# EAGLE design OpenLog (EAGLE 6.5.0)
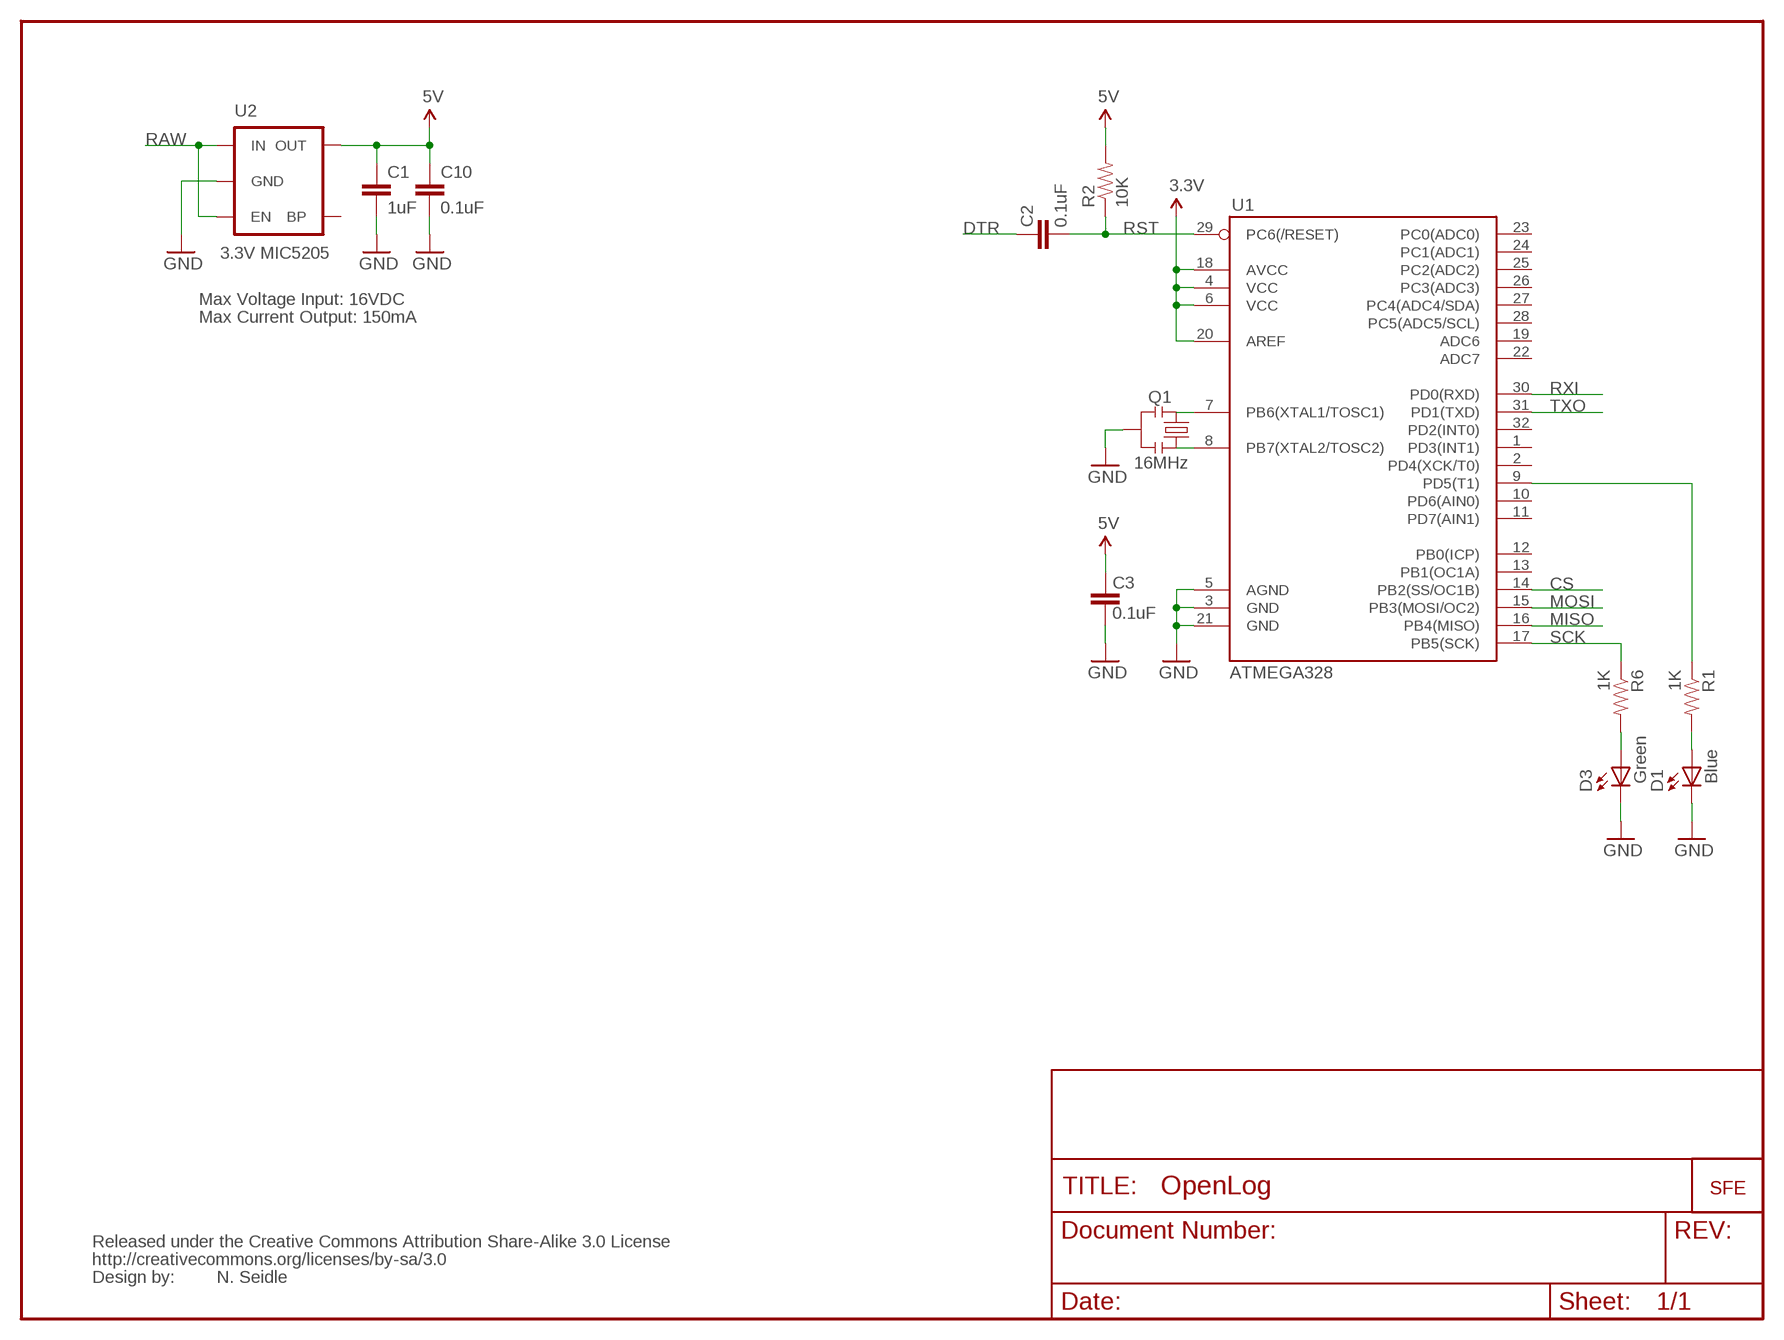
[diagram p0: schematic, sheet 1]

## Parts
C1  1uF  CAP0402-CAP  [0402-CAP]
C2  0.1uF  CAP0402-CAP  [0402-CAP]
C3  0.1uF  CAP0402-CAP  [0402-CAP]
C10  0.1uF  CAP0402-CAP  [0402-CAP]
D1  Blue  LED0603  [LED-0603]
D3  Green  LED0603  [LED-0603]
Q1  16MHz  RESONATORSMD  [RESONATOR-SMD]
R1  1K  RESISTOR0402-RES  [0402-RES]
R2  10K  RESISTOR0402-RES  [0402-RES]
R6  1K  RESISTOR0402-RES  [0402-RES]
U1  ATMEGA328  ATMEGA168  [TQFP32-08]
U2  3.3V MIC5205  V_REG_LDOSMD  [SOT23-5]
U$1  LOGO-SFESK  [SFE-LOGO-FLAME]
U$2  CREATIVE_COMMONS  [CREATIVE_COMMONS]

## Nets
3.3V: U1.4(VCC) U1.6(VCC) U1.18(AVCC) U1.20(AREF)
5V: C1.1 C3.2 C10.1 R2.2 U2.5(OUT)
CS: U1.14(PB2(SS/OC1B))
DTR: C2.2
GND [vcc]: C1.2 C3.1 C10.2 D1.C D3.C Q1.2 U1.3(GND) U1.5(AGND) U1.21(GND) U2.2(GND)
MISO: U1.16(PB4(MISO))
MOSI: U1.15(PB3(MOSI/OC2))
N$1: Q1.1 U1.8(PB7(XTAL2/TOSC2))
N$2: Q1.3 U1.7(PB6(XTAL1/TOSC1))
N$3: D1.A R1.2
N$4: R1.1 U1.9(PD5(T1))
N$7: D3.A R6.2
RAW [vcc]: U2.1(IN) U2.3(EN)
RST: C2.1 R2.1 U1.29(PC6(/RESET))
RXI: U1.30(PD0(RXD))
SCK: R6.1 U1.17(PB5(SCK))
TXO: U1.31(PD1(TXD))
Unconnected: U1.1(PD3(INT1)) U1.2(PD4(XCK/T0)) U1.10(PD6(AIN0)) U1.11(PD7(AIN1)) U1.12(PB0(ICP)) U1.13(PB1(OC1A)) U1.19(ADC6) U1.22(ADC7) U1.23(PC0(ADC0)) U1.24(PC1(ADC1)) U1.25(PC2(ADC2)) U1.26(PC3(ADC3)) U1.27(PC4(ADC4/SDA)) U1.28(PC5(ADC5/SCL)) U1.32(PD2(INT0)) U2.4(BP)

## Notes on the sheet
- Max Voltage Input: 16VDC
- Max Current Output: 150mA
- N. Seidle

## Library data of the parts
C1-C3 C10 = SparkFun:CAP: Capacitor Standard 0603 ceramic capacitor, and 0.1" leaded capacitor.
D1 D3 = SparkFun:LED: LEDs Standard schematic elements and footprints for 5mm, 3mm, 1206, and 0603 sized LEDs. 5mm - Spark Fun Electronics SKU : COM-00529 (and others)
Q1 = SparkFun:RESONATOR: Resonator Small SMD resonator. This is the itty bitty 10/20MHz resonators with built in caps. CSTCE10M0G55 and CSTCE20M0V53. Footprint has been reviewed closely but hasn't been tested yet.
R1 R2 R6 = SparkFun:RESISTOR: Resistor Basic schematic elements and footprints for 0603, 1206, and PTH 1/10th watt (small) resistors.
U1 = SparkFun:ATMEGA168
U2 = SparkFun:V_REG_LDO: Voltage Regulator LDO Standard 150mA LDO voltage regulator in SOT-23 layout. Micrel part MIC5205. BP (by-pass) pin is used to lower output noise with 470pF cap.
U$1 = SparkFun:LOGO-SFE: Spark Fun Electronics PCB Logo This is the standard Spark Fun Electronics PCB logo.
U$2 = SparkFun:CREATIVE_COMMONS

## Net classes
0 default: width 0.178 mm
1 vcc: width 0.203 mm

## Board
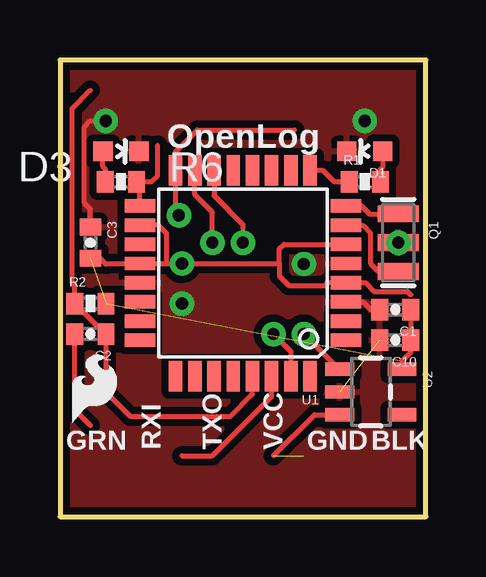
[diagram p1: board, top side]
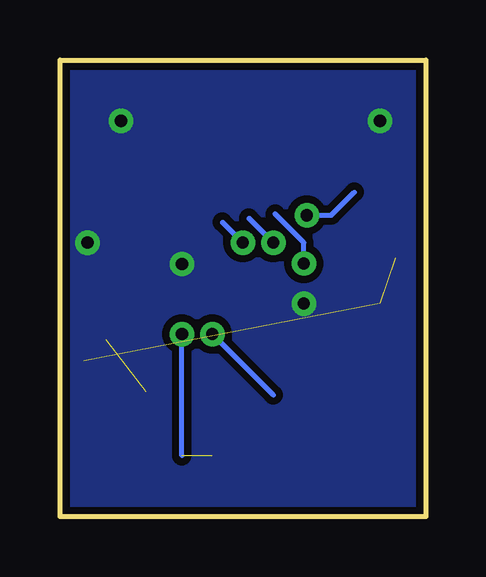
[diagram p2: board, bottom side, seen from below]

Size 15.24 x 19.05 mm. Coordinates in mm from the lower left corner, seen from the top.
Outline: 15.24,0 15.24,19.05 0,19.05 0,0 15.24,0
Copper layers (1*16): Top 0.035mm / dielectric 1.5mm / Bottom 0.035mm
Design rules "SparkFun": minimum track width 8mil, minimum drill 20mil, track to track 8mil, track to pad 8mil, pad to pad 8mil, via to via 8mil, smd to smd 8mil, copper to edge 10mil, drill to drill 8mil, minimum pad ring 12mil, minimum via ring 10mil, stop-mask expansion 4mil, vias tented up to drill 20mil, thermal gap 10mil

### Footprints (pad centres in the part's own frame; a part is rotated, then mirrored left to right if it is on the bottom)
0402-CAP = smd 0.7 x 0.9: 1 -0.65,0; 2 0.65,0
LED-0603 = smd 0.8 x 0.8: A 0,-0.75; C 0,0.75
RESONATOR-SMD = smd 0.7 x 1.7: 1 -1.2,0; 2 0,0; 3 1.2,0
0402-RES = smd 0.7 x 0.9: 1 -0.65,0; 2 0.65,0
TQFP32-08 = smd 1.27 x 0.559: 1 -4.293,2.8; 2 -4.293,2; 3 -4.293,1.2; 4 -4.293,0.4; 5 -4.293,-0.4; 6 -4.293,-1.2; 7 -4.293,-2; 8 -4.293,-2.8; 17 4.293,-2.8; 18 4.293,-2; 19 4.293,-1.2; 20 4.293,-0.4; 21 4.293,0.4; 22 4.293,1.2; 23 4.293,2; 24 4.293,2.8 | smd 0.559 x 1.27: 9 -2.8,-4.293; 10 -2,-4.293; 11 -1.2,-4.293; 12 -0.4,-4.293; 13 0.4,-4.293; 14 1.2,-4.293; 15 2,-4.293; 16 2.8,-4.293; 25 2.8,4.293; 26 2,4.293; 27 1.2,4.293; 28 0.4,4.293; 29 -0.4,4.293; 30 -1.2,4.293; 31 -2,4.293; 32 -2.8,4.293
SOT23-5 = smd 0.55 x 1.2: 1 -0.95,-1.3; 2 0,-1.3; 3 0.95,-1.3; 4 0.95,1.3; 5 -0.95,1.3

### Placement (x,y rotation side)
C1  13.97,8.64 180 top
C2  1.27,7.62 180 top
C3  1.27,11.43 270 top
C10  13.97,7.37 180 top
D1  12.7,15.24 90 top
D3  2.54,15.24 270 top
Q1  14.1,11.43 270 top
R1  12.7,13.97 0 top
R2  1.27,8.89 0 top
R6  2.54,13.97 180 top
U1  7.62,10.16 180 top
U2  12.95,5.21 270 top
U$1  0.51,3.94 0 top
U$2  19.05,-11.43 0 top  (outside the outline)

### Tracks (layer width: path | path; a pad name or v marks a point on that pad's centre or on a via)
3.3V  (via drill 0.51)
  Top 0.203: 4.45,10.56 U1.20 1.92,10.56 1.91,10.54 | U1.18 4.1,12.16 4.45,11.81 4.45,10.56 | 1.91,10.54 1.67,10.78 | 1.92,10.53 1.91,10.54 | 4.45,10.56 v5.08,10.56 9.12,10.56 | U1.6 9.33,11.36 9.14,11.18 9.14,10.58 9.12,10.56 | 9.12,10.56 9.14,10.54 9.14,10.03 9.53,9.65 11.05,9.65 11.16,9.76 U1.4 12.72,9.76 13.08,9.4 14.48,9.4 14.62,9.26
  Bottom 0.203: 6.28,12.62 5.08,11.43 v5.08,10.56
5V  (2 unrouted)
  Top 0.203: U2.5 14.25,6.51 14.61,6.86 14.61,7.61 C10.1 C1.1
CS  (via drill 0.51)
  Top 0.203: U1.14 6.42,13.39 7.62,12.19 v7.62,11.43
  Bottom 0.203: v7.62,11.43 8.47,12.29
DTR
  Top 0.203: C2.2 0.62,4.46 1.27,3.81
GND  (via drill 0.51)  (1 unrouted)
  Top 0.203: C3.1 1.27,12.83 1.02,13.08 1.02,16.26 1.27,16.51 v1.91,16.51 | C1.2 12.95,8.64 12.63,8.96 U1.3
  other vias: 5.08,8.89 12.7,16.51 14.1,11.43 10.16,10.54
  pour Top (isolate 0.305): 15.24,0 0,0 0,19.05 15.24,19.05
  pour Bottom (isolate 0.305): 15.24,0 0,0 0,19.05 15.24,19.05
MISO  (via drill 0.51)
  Top 0.203: 9.78,16.13 5.71,16.13 4.82,15.23 U1.16 4.82,12.71 v4.95,12.57
  Bottom 0.203: v4.95,12.57 3.94,12.57 2.98,13.54
MOSI  (via drill 0.51)
  Top 0.203: U1.15 5.62,13.43 6.35,12.7 v6.35,11.43
  Bottom 0.203: v6.35,11.43 7.38,12.46
N$1
  Top 0.203: U1.8 12.57,12.96 12.9,12.63 Q1.1
N$2
  Top 0.203: Q1.3 13.27,10.23 12.93,10.57 12.93,11.84 12.61,12.16 U1.7
N$3
  Top 0.203: R1.2 13.35,14.49 13.46,14.61 13.46,15.23 D1.A
N$4
  Top 0.203: U1.9 10.95,14.45 11.43,13.97 R1.1
N$7
  Top 0.203: D3.A 1.79,14.59 1.91,14.48 1.91,13.98 R6.2
RAW  (via drill 0.51)  (1 unrouted)
  Top 0.203: U2.3 10.61,4.26 8.89,2.54 | U2.1 11.62,6.16 v10.16,7.62
  Bottom 0.203: 10.16,2.54 v10.16,7.62
RST
  Top 0.203: U1.29 8.02,5.1 7.11,4.19 2.92,4.19 1.92,5.19 C2.1 1.89,7.62 R2.1 0.62,9.67 0.51,9.78 0.51,17.02 1.27,17.78
RXI
  Top 0.203: U1.30 8.82,5.01 6.35,2.54 5.08,2.54
SCK
  Top 0.203: U1.17 3.33,13.83 R6.1 3.81,13.97 4.06,14.22 4.06,15.49
TXO  (via drill 0.51)
  Top 0.203: U1.31 9.62,6.89 v8.89,7.62
  Bottom 0.203: 6.35,5.08 v8.89,7.62

### Text on the board
tPlace: OpenLog | GRN | RXI | TXO | VCC | GND | BLK | N. Seidle